# EAGLE design HIP4081A v1.2 (EAGLE 7.7.0)
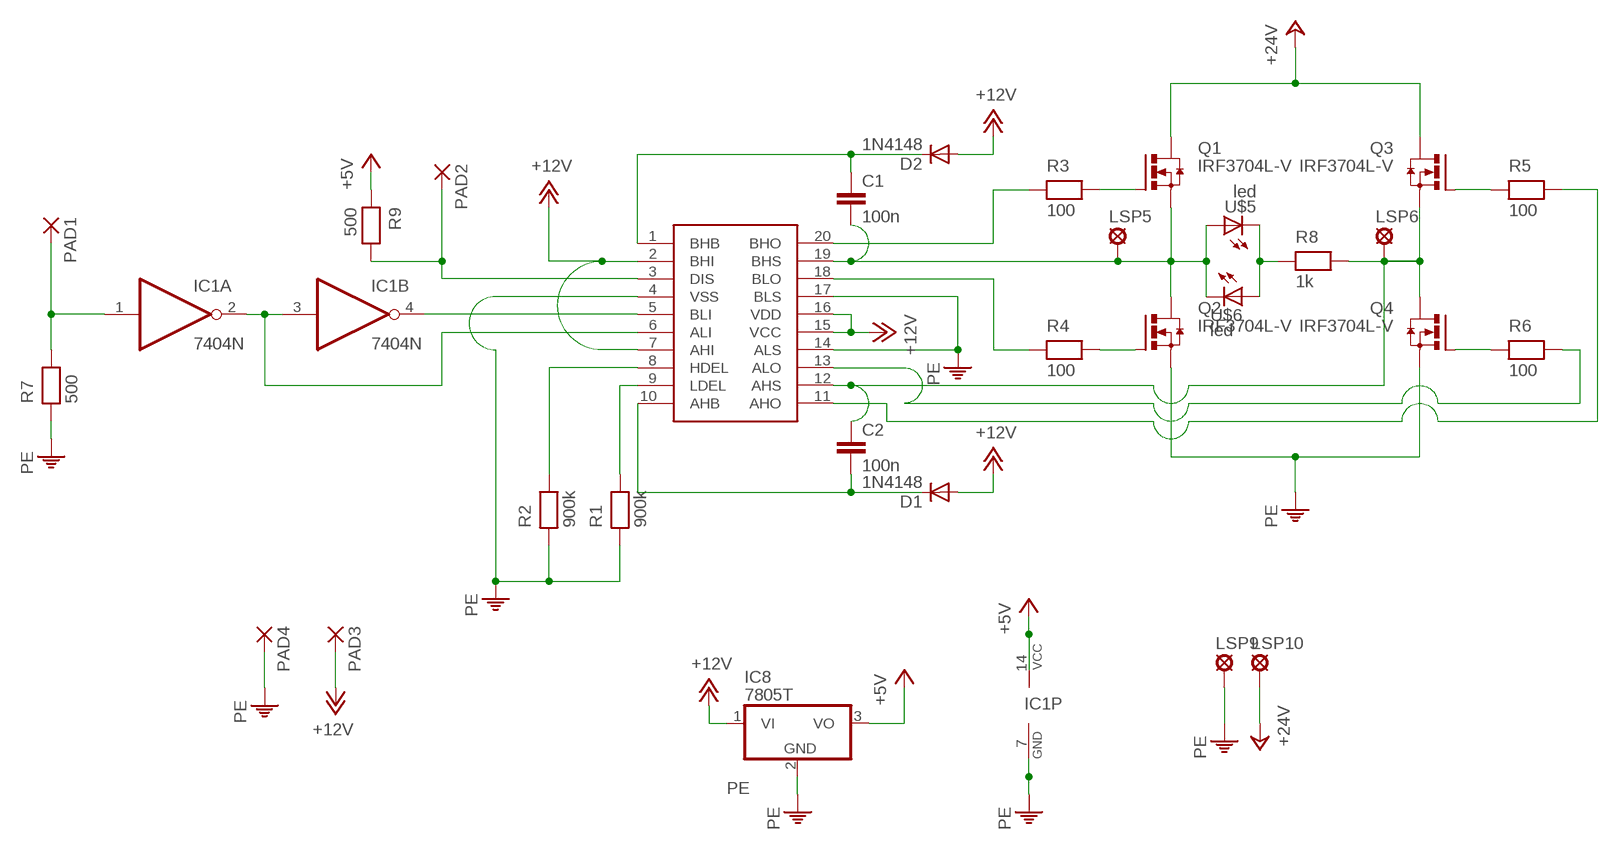
[diagram p0: schematic, sheet 1]

## Parts
C1  100n  C5/2.5  [C5B2.5]
C2  100n  C5/2.5  [C5B2.5]
D1  1N4148  [DO35-10]
D2  1N4148  [DO35-10]
IC1  7404N  [DIL14]
IC2  HIP4081A  [DIL20]
IC8  7805T  [TO220H]
LSP5  SE14  [SE14]
LSP6  SE14  [SE14]
LSP9  SE14  [SE14]
LSP10  SE14  [SE14]
PAD1  1,6/0,8  [1,6/0,8]
PAD2  1,6/0,8  [1,6/0,8]
PAD3  1,6/0,8  [1,6/0,8]
PAD4  1,6/0,8  [1,6/0,8]
Q1  IRF3704L-V  [TO262-V]
Q2  IRF3704L-V  [TO262-V]
Q3  IRF3704L-V  [TO262-V]
Q4  IRF3704L-V  [TO262-V]
R1  900k  RESEU-10  [R-10]
R2  900k  RESEU-10  [R-10]
R3  100  RESEU-10  [R-10]
R4  100  RESEU-10  [R-10]
R5  100  RESEU-10  [R-10]
R6  100  RESEU-10  [R-10]
R7  500  RESEU-10  [R-10]
R8  1k  RESEU-10  [R-10]
R9  500  RESEU-10  [R-10]
U$5  led  LED3MM  [LED3MM]
U$6  led  LED3MM  [LED3MM]

## Nets
+5V: IC1.14(P:VCC) IC8.3(VO) R9.1
+12V: D1.A D2.A IC2.2(BHI) IC2.7(AHI) IC2.15(VCC) IC2.16(VDD) IC8.1(VI) PAD3.1(P)
+24V: LSP10.MP Q1.2(D) Q3.2(D)
N$1: C1.2 IC2.19(BHS) LSP5.MP Q1.3(S) Q2.2(D) U$5.A U$6.K(C)
N$2: C2.1 IC2.12(AHS) LSP6.MP Q3.3(S) Q4.2(D) R8.2
N$3: IC2.20(BHO) R3.1
N$4: IC2.18(BLO) R4.1
N$5: IC1.4(B:O) IC2.5(BLI)
N$6: R8.1 U$5.K(C) U$6.A
N$7: IC2.9(LDEL) R1.2
N$9: IC2.8(HDEL) R2.2
N$10: C1.1 D2.C IC2.1(BHB)
N$11: IC2.11(AHO) R5.2
N$12: IC2.13(ALO) R6.2
N$13: C2.2 D1.C IC2.10(AHB)
N$15: IC2.3(DIS) PAD2.1(P) R9.2
N$16: Q2.1(G) R4.2
N$17: Q4.1(G) R6.1
N$18: Q3.1(G) R5.1
N$19: Q1.1(G) R3.2
N$20: IC1.1(A:I) PAD1.1(P) R7.2
N$21: IC1.2(A:O) IC1.3(B:I) IC2.6(ALI)
PE: IC1.7(P:GND) IC2.4(VSS) IC2.14(ALS) IC2.17(BLS) IC8.2(GND) LSP9.MP PAD4.1(P) Q2.3(S) Q4.3(S) R1.1 R2.1 R7.1
Unconnected: IC1.5(C:I) IC1.6(C:O) IC1.8(D:O) IC1.9(D:I) IC1.10(E:O) IC1.11(E:I) IC1.12(F:O) IC1.13(F:I)

## Library data of the parts
C1 C2 = capacitor-wima:C: CAPACITOR naming: grid - package width
D1 D2 = diode:1N4148: DIODE high speed (Philips)
IC1 = 74xx-us:74*04: Hex INVERTER
IC2 = intersil:HIP4081A
IC8 = linear:78*: Positive VOLTAGE REGULATOR Source: http://cache.national.com/ds/LM/LM78L05.pdf http://www.fairchildsemi.com/ds/LM/LM7805.pdf
LSP5 LSP6 LSP9 LSP10 = solpad:SE14: SOLDER PAD E1553, drill 1,4mm, distributor Buerklin, 07F820
PAD1-PAD4 = wirepad:1,6/0,8: THROUGH-HOLE PAD
Q1-Q4 = transistor-power:IRF3704: SMPS MOSFET HEXFET® Power MOSFET Source: http://www.irf.com/product-info/datasheets/data/irf3704.pdf
R1-R9 = discrete:RESEU-10
U$5 U$6 = led:LED: LED OSRAM: - CHIPLED LG R971, LG N971, LY N971, LG Q971, LY Q971, LO R971, LY R971 LH N974, LH R974 LS Q976, LO Q976, LY Q976 LO Q996 - Hyper CHIPLED LW Q18S LB Q993, LB Q99A, LB R99A - SideLED LS A670, LO A670, LY A670, LG A670, LP A670 LB A673, LV A673, LT A673, LW A673 LH A674 LY A675 LS A676, LA A676, LO A676, LY A676, LW A676 LS A679, LY A679, LG A679 - Hyper Micro SIDELED® LS Y876, LA Y876, LO Y876, LY Y876 LT Y87S - SmartLED LW L88C, LW L88S LB L89C, LB L89S, LG L890 LS L89K, LO L89K, LY L89K LS L896, LA L896, LO L896, LY L896 - TOPLED LS T670, LO T670, LY T670, LG T670, LP T670 LSG T670, LSP T670, LSY T670, LOP T670, LYG T670 LG T671, LOG T671, LSG T671 LB T673, LV T673, LT T673, LW T673 LH T674 LS T676, LA T676, LO T676, LY T676, LB T676, LH T676, LSB T676, LW T676 LB T67C, LV T67C, LT T67C, LS T67K, LO T67K, LY T67K, LW E67C LS E67B, LA E67B, LO E67B, LY E67B, LB E67C, LV E67C, LT E67C LW T67C LS T679, LY T679, LG T679 LS T770, LO T770, LY T770, LG T770, LP T770 LB T773, LV T773, LT T773, LW T773 LH T774 LS E675, LA E675, LY E675, LS T675 LS T776, LA T776, LO T776, LY T776, LB T776 LHGB T686 LT T68C, LB T68C - Hyper Mini TOPLED® LB M676 - Mini TOPLED Santana® LG M470 LS M47K, LO M47K, LY M47K Source: http://www.osram.convergy.de - LUMILED® LXK2-PW12-R00, LXK2-PW12-S00, LXK2-PW14-U00, LXK2-PW14-V00 LXK2-PM12-R00, LXK2-PM12-S00, LXK2-PM14-U00 LXK2-PE12-Q00, LXK2-PE12-R00, LXK2-PE12-S00, LXK2-PE14-T00, LXK2-PE14-U00 LXK2-PB12-K00, LXK2-PB12-L00, LXK2-PB12-M00, LXK2-PB14-N00, LXK2-PB14-P00, LXK2-PB14-Q00 LXK2-PR12-L00, LXK2-PR12-M00, LXK2-PR14-Q00, LXK2-PR14-R00 LXK2-PD12-Q00, LXK2-PD12-R00, LXK2-PD12-S00 LXK2-PH12-R00, LXK2-PH12-S00 LXK2-PL12-P00, LXK2-PL12-Q00, LXK2-PL12-R00 Source: www.luxeon.com

## Board
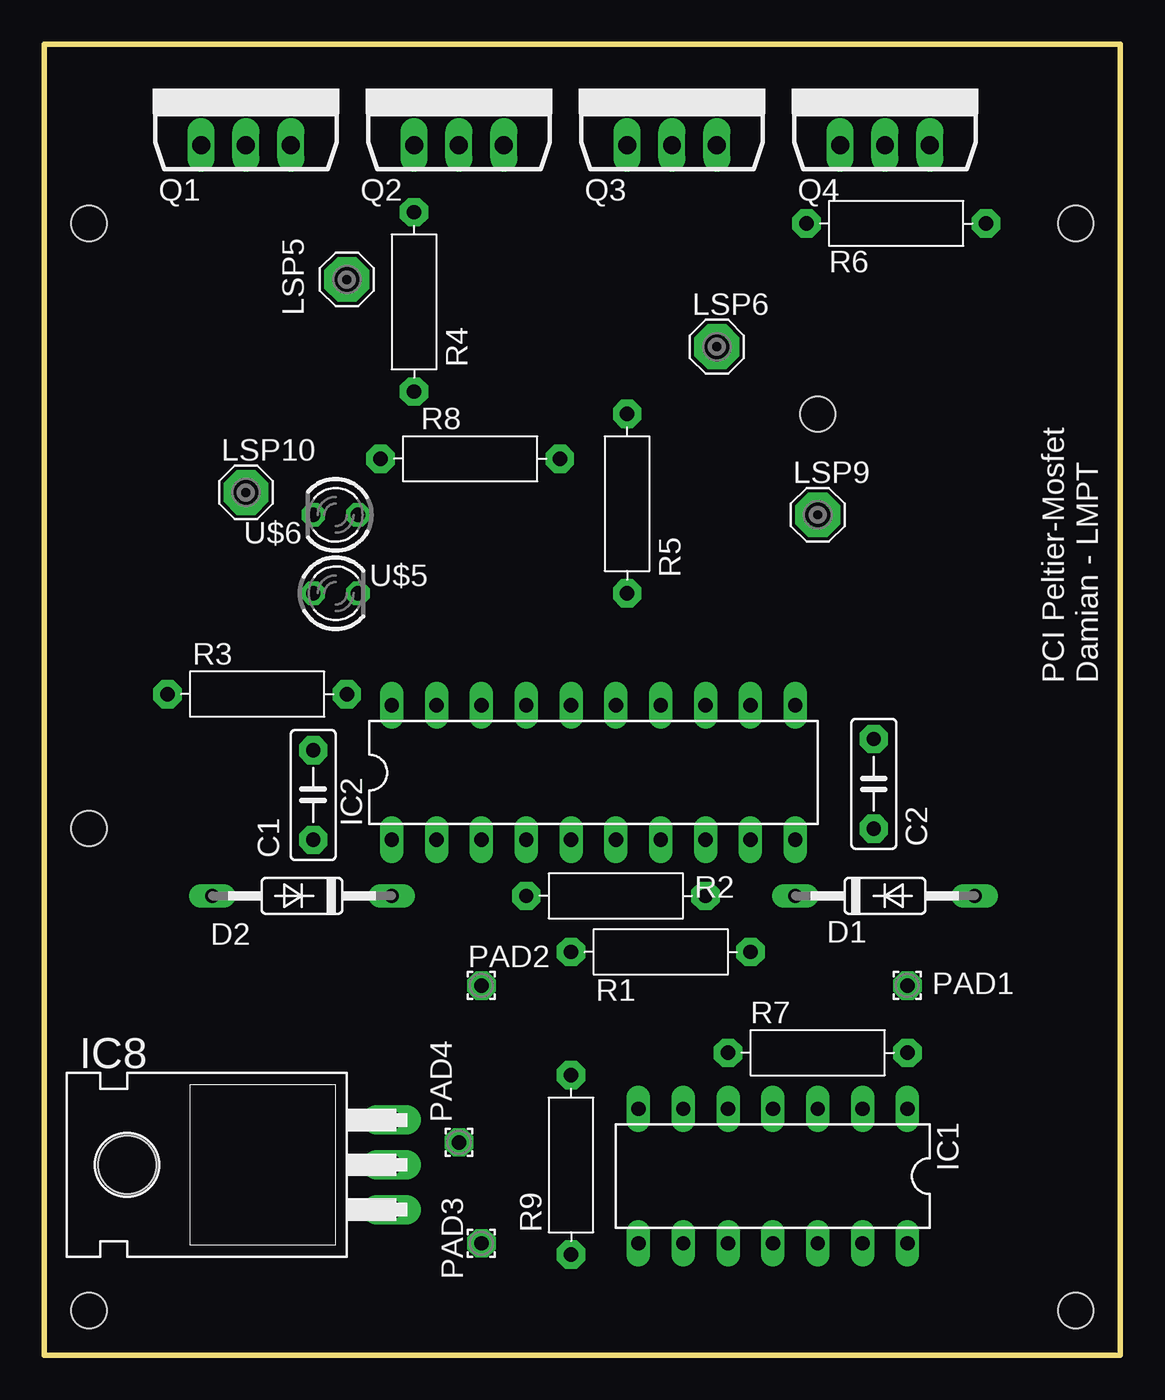
[diagram p1: board, top side]
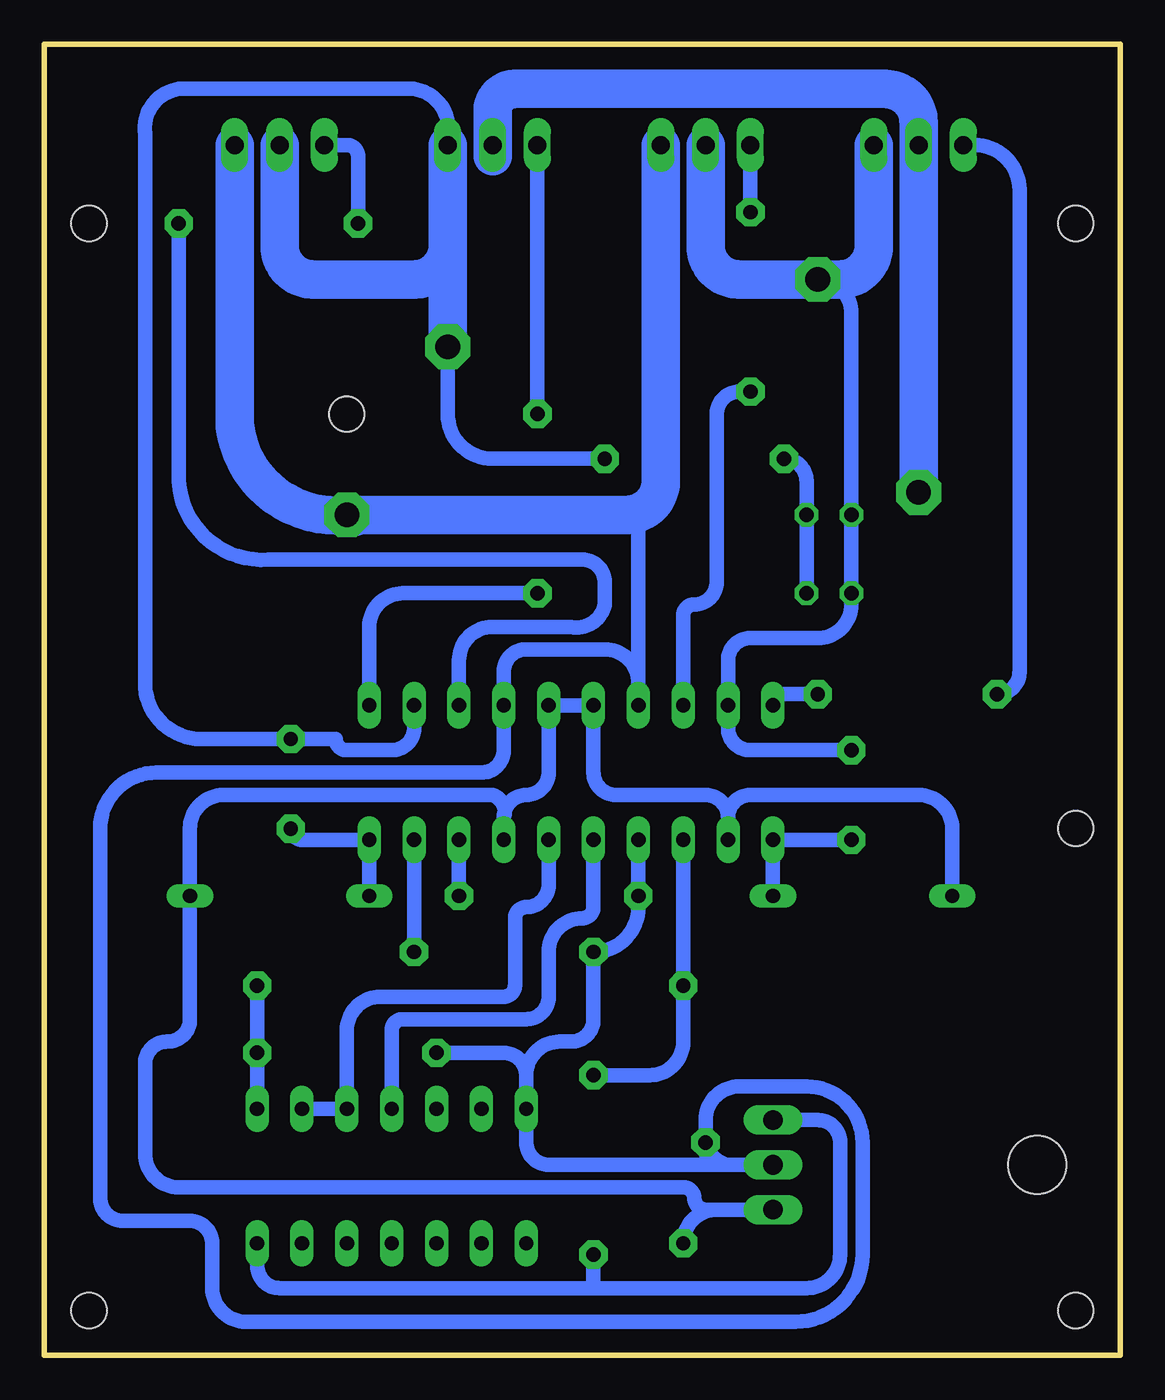
[diagram p2: board, bottom side, seen from below]

Size 60.96 x 74.29 mm. Coordinates in mm from the lower left corner, seen from the top.
Outline: 60.96,0 60.96,74.29 0,74.29 0,0 60.96,0
Copper layers 16: Bottom 0.035mm
Design rules "default": minimum track width 10mil, minimum drill 24mil, track to track 8mil, track to pad 8mil, pad to pad 8mil, via to via 8mil, smd to smd 8mil, copper to edge 40mil, drill to drill 8mil, minimum pad ring 10mil, minimum via ring 8mil, stop-mask expansion 4mil, vias tented up to drill 0mil, thermal gap 10mil
Holes 2 mm at 2.54,64.13 58.42,64.13 2.54,2.54 58.42,2.54 2.54,29.84 43.82,53.34

### Footprints (pad centres in the part's own frame; a part is rotated, then mirrored left to right if it is on the bottom)
C5B2.5 = drill 0.813 pad 1.6 octagon: 1 -2.54,0; 2 2.54,0
DO35-10 = drill 0.813 long: A 5.08,0; C -5.08,0
DIL14 = drill 0.813 long: 1 -7.62,-3.81; 2 -5.08,-3.81; 3 -2.54,-3.81; 4 0,-3.81; 5 2.54,-3.81; 6 5.08,-3.81; 7 7.62,-3.81; 8 7.62,3.81; 9 5.08,3.81; 10 2.54,3.81; 11 0,3.81; 12 -2.54,3.81; 13 -5.08,3.81; 14 -7.62,3.81
DIL20 = drill 0.813 long: 1 -11.43,-3.81; 2 -8.89,-3.81; 3 -6.35,-3.81; 4 -3.81,-3.81; 5 -1.27,-3.81; 6 1.27,-3.81; 7 3.81,-3.81; 8 6.35,-3.81; 9 8.89,-3.81; 10 11.43,-3.81; 11 11.43,3.81; 12 8.89,3.81; 13 6.35,3.81; 14 3.81,3.81; 15 1.27,3.81; 16 -1.27,3.81; 17 -3.81,3.81; 18 -6.35,3.81; 19 -8.89,3.81; 20 -11.43,3.81
TO220H = drill 1.118 long: 1 -2.54,-10.16; 2 0,-10.16; 3 2.54,-10.16 | hole 3.302: 0,4.826
SE14 = drill 1.397 pad 2.54 octagon: MP 0,0
1,6/0,8 = drill 0.813 pad 1.6 octagon: 1 0,0
TO262-V = drill 1.016 long: 1 -2.54,0; 2 0,0; 3 2.54,0
R-10 = drill 0.813 pad 1.6 octagon: 1 -5.08,0; 2 5.08,0
LED3MM = drill 0.813 octagon: A -1.27,0; K 1.27,0

### Placement (x,y rotation side)
C1  15.24,31.75 90 top
C2  46.99,32.38 270 top
D1  47.63,26.03 0 top
D2  14.61,26.03 180 top
IC1  41.28,10.16 180 top
IC2  31.12,33.02 0 top
IC8  9.53,10.79 90 top
LSP5  17.15,60.96 0 top
LSP6  38.1,57.15 0 top
LSP9  43.82,47.62 0 top
LSP10  11.43,48.89 0 top
PAD1  48.9,20.95 0 top
PAD2  24.77,20.95 0 top
PAD3  24.77,6.35 0 top
PAD4  23.5,12.06 0 top
Q1  11.43,68.58 0 top
Q2  23.5,68.58 0 top
Q3  35.56,68.58 0 top
Q4  47.63,68.58 0 top
R1  34.93,22.86 0 top
R2  32.39,26.03 0 top
R3  12.07,37.47 180 top
R4  20.96,59.69 90 top
R5  33.02,48.26 270 top
R6  48.26,64.13 0 top
R7  43.82,17.14 0 top
R8  24.13,50.8 0 top
R9  29.84,10.79 90 top
U$5  16.51,43.18 0 top
U$6  16.51,47.62 180 top

### Tracks (layer width: path | path; a pad name or v marks a point on that pad's centre or on a via)
+5V
  Bottom 0.813: IC1.14 48.9,5.08 arc-90 47.63,3.81 29.84,3.81 | 29.84,3.81 17.78,3.81 arc-90 15.88,5.72 15.88,12.06 arc-90 17.15,13.33 IC8.3 | 29.84,3.81 R9.1
+12V
  Bottom 0.61: 34.93,30.48 IC2.7
  Bottom 0.813: D2.A 9.53,29.84 arc-90 11.43,31.75 20.96,31.75 arc-90 22.23,30.48 | 22.23,30.48 arc-90 23.5,31.75 28.58,31.75 arc90 29.84,33.02 IC2.16 IC2.15 32.39,33.02 arc90 33.66,31.75 arc-90 34.93,30.48 arc-90 35.56,31.75 50.8,31.75 arc-90 52.71,29.84 D1.A 52.71,19.05 arc90 53.98,17.78 arc-90 55.25,16.51 55.25,11.43 arc-90 53.34,9.53 24.77,9.53 arc90 24.13,8.89 arc-90 23.5,8.25 IC8.1 22.86,8.25 arc-90 PAD3.1 | 22.23,30.48 IC2.2
+24V
  Bottom 2.184: 35.56,67.94 Q3.2 35.56,70.48 arc90 34.29,71.75 13.34,71.75 arc90 11.43,69.85 Q1.2 LSP10.MP
N$1
  Bottom 0.813: C1.2 20.96,34.29 arc90 22.23,35.56 IC2.19 22.23,39.37 arc90 20.96,40.64 17.15,40.64 arc-90 15.24,42.54 U$5.A U$6.K 15.24,59.05 arc-90 LSP5.MP
  Bottom 2.184: Q1.3 13.97,62.86 arc90 15.88,60.96 LSP5.MP 21.59,60.96 arc90 23.5,62.86 Q2.2
N$2
  Bottom 0.61: 38.1,62.86 arc90 40.01,60.96
  Bottom 0.813: IC2.12 40.01,35.56 arc90 41.28,34.29 43.82,34.29 arc90 44.45,34.92 C2.1 52.07,34.92 arc90 55.25,38.1 55.25,69.22 arc90 53.34,71.75 40.64,71.75 arc90 38.1,69.85 38.1,67.31 | R8.2 35.56,50.8 arc90 38.1,53.34 LSP6.MP | 38.1,59.05 arc-90 40.01,60.96
  Bottom 2.184: 38.1,67.31 38.1,62.86 arc90 40.01,60.96 45.72,60.96 arc90 47.63,62.86 Q4.2 | 38.1,67.31 Q3.3 | 38.1,67.31 LSP6.MP 38.1,59.05
N$3
  Bottom 0.813: R3.1 19.05,37.47 arc-90 IC2.20
N$4
  Bottom 0.813: R4.1 21.59,54.61 arc-90 22.86,53.34 22.86,43.81 arc90 24.13,42.54 arc-90 24.77,41.91 IC2.18
N$5
  Bottom 0.813: IC1.4 41.28,18.41 arc90 40.64,19.05 33.66,19.05 arc-90 32.39,20.32 32.39,22.86 arc90 30.48,24.76 arc-90 29.84,25.4 IC2.5
N$6
  Bottom 0.813: U$5.K U$6.A 17.78,49.53 arc-90 R8.1
N$7
  Bottom 0.813: IC2.9 R1.2
N$9
  Bottom 0.813: IC2.8 R2.2
N$10
  Bottom 0.813: D2.C IC2.1 C1.1
N$11
  Bottom 0.813: R5.2 40.64,43.18 arc-90 42.55,41.28 IC2.11
N$12
  Bottom 0.813: R6.2 53.34,49.53 arc-90 48.26,45.08 30.48,45.08 arc90 29.21,43.81 29.21,42.54 arc90 31.12,41.28 35.56,41.28 arc-90 37.47,39.37 IC2.13
N$13
  Bottom 0.813: D1.C IC2.10 46.36,29.21 arc90 C2.2
N$15
  Bottom 0.813: R9.2 26.67,15.88 arc-90 24.77,17.78 24.77,20.32 | 24.77,20.32 PAD2.1 | IC2.3 24.77,20.32
N$16
  Bottom 0.813: Q2.1 R4.2
N$17
  Bottom 0.813: Q4.1 43.82,68.58 arc90 43.18,67.94 R6.1
N$18
  Bottom 0.813: Q3.1 R5.1
N$19
  Bottom 0.813: R3.2 arc-90 5.72,38.73 5.72,66.04 arc-90 8.26,68.58 Q1.1
N$20
  Bottom 0.813: IC1.1 R7.2 PAD1.1
N$21
  Bottom 0.813: IC1.2 IC1.3 43.82,18.41 arc90 41.91,20.32 34.93,20.32 arc-90 34.29,20.95 34.29,24.76 arc90 33.66,25.4 arc-90 32.39,26.67 IC2.6
PE
  Bottom 0.61: 27.94,47.62 arc90 27.31,46.99
  Bottom 0.813: 22.23,10.79 32.39,10.79 arc90 33.66,12.06 IC1.7 33.66,15.88 | 22.23,10.79 IC8.2 22.86,10.79 arc90 PAD4.1 | 22.23,10.79 arc90 23.5,12.7 23.5,13.33 arc90 21.59,15.24 17.78,15.24 arc90 14.61,12.06 14.61,5.72 arc90 18.42,1.91 49.53,1.91 arc90 51.44,3.81 51.44,6.35 arc-90 52.71,7.62 56.52,7.62 arc90 57.79,8.89 57.79,29.84 arc90 54.61,33.02 36.2,33.02 arc-90 34.93,34.29 IC2.14 34.93,38.73 | IC2.4 R2.1 27.31,25.4 arc90 R1.1 29.84,19.05 arc90 31.12,17.78 31.75,17.78 arc-90 33.66,15.88 | 27.31,38.1 arc-90 29.21,40 | 33.66,40 arc-90 34.93,38.73 | 27.31,38.1 IC2.17 27.31,46.99 | 27.31,38.1 arc-90 29.21,40 | 29.21,40 33.66,40 | 33.66,40 arc-90 34.93,38.73 | 33.66,15.88 arc-90 34.93,17.14 R7.1
  Bottom 2.184: Q4.3 50.17,52.7 arc-90 LSP9.MP arc-90 43.18,47.62 27.94,47.62 arc-90 26.04,49.53 Q2.3

### Text on the board
tNames: PCI Peltier-Mosfet / Damian - LMPT